# EAGLE schematic maclight-v2 (EAGLE 7.1.0)
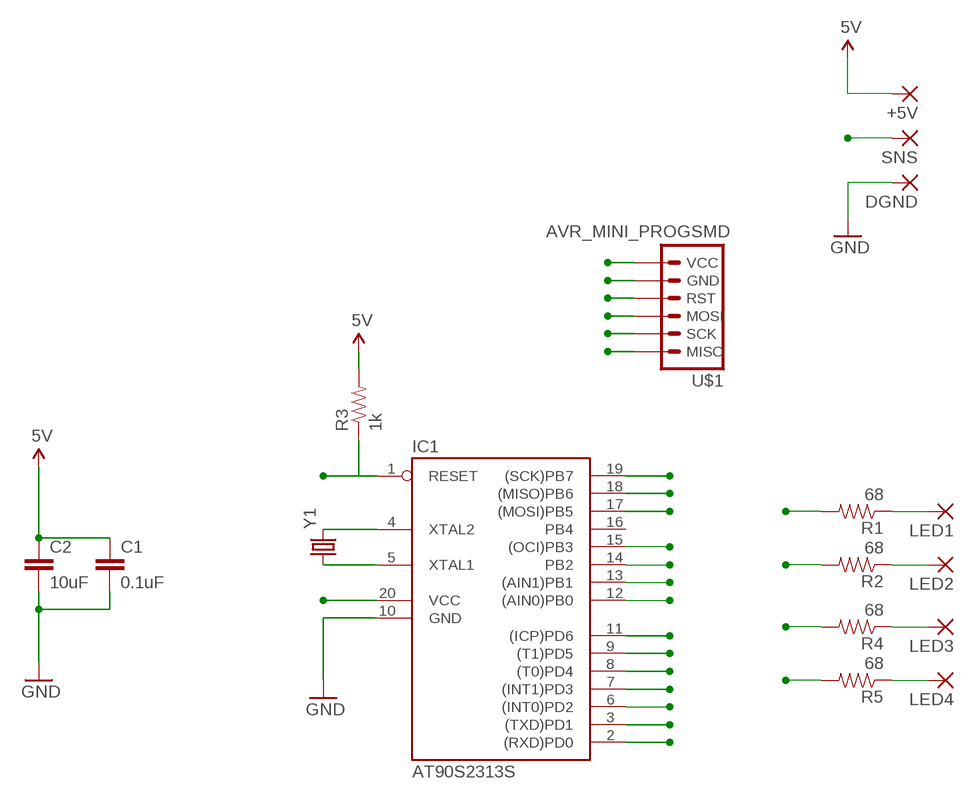
[diagram p0: schematic, sheet 1]

## Parts
+5V  SMD2  [SMD1,27-2,54]
C1  0.1uF  CAP0805  [0805]
C2  10uF  CAP1210  [1210]
DGND  SMD2  [SMD1,27-2,54]
IC1  AT90S2313S  [SO20L]
LED1  SMD2  [SMD1,27-2,54]
LED2  SMD2  [SMD1,27-2,54]
LED3  SMD2  [SMD1,27-2,54]
LED4  SMD2  [SMD1,27-2,54]
R1  68  RESISTOR0805-RES  [0805]
R2  68  RESISTOR0805-RES  [0805]
R3  1k  RESISTOR0805-RES  [0805]
R4  68  RESISTOR0805-RES  [0805]
R5  68  RESISTOR0805-RES  [0805]
SNS  SMD2  [SMD1,27-2,54]
U$1  AVR_MINI_PROGSMD  [AVR_MINI_PROG]
Y1  CRYSTAL5X3  [CRYSTAL-SMD-5X3]

## Nets
5V: +5V.1(P) C1.1 C2.1 IC1.20(VCC) R3.2 U$1.1(VCC)
/OE: IC1.11((ICP)PD6)
CLK: IC1.8((T0)PD4)
DATA: IC1.9((T1)PD5)
GND: C1.2 C2.2 DGND.1(P) IC1.10(GND) U$1.2(GND)
LE: IC1.7((INT1)PD3)
LED1: IC1.12((AIN0)PB0) R1.2
LED2: IC1.13((AIN1)PB1) R2.2
LED3: IC1.14(PB2) R4.2
LED4: IC1.15((OCI)PB3) R5.2
MISO: IC1.18((MISO)PB6) U$1.6(MISO)
MOSI/SDA: IC1.17((MOSI)PB5) U$1.4(MOSI)
N$1: LED4.1(P) R5.1
N$2: LED3.1(P) R4.1
N$3: LED2.1(P) R2.1
N$4: LED1.1(P) R1.1
N$10: IC1.5(XTAL1) Y1.1
N$12: IC1.4(XTAL2) Y1.3
PWR_SENSE: IC1.6((INT0)PD2) SNS.1(P)
RESET: IC1.1(RESET) R3.1 U$1.3(RST)
RX: IC1.2((RXD)PD0)
SCK/SCL: IC1.19((SCK)PB7) U$1.5(SCK)
TX: IC1.3((TXD)PD1)
Unconnected: IC1.16(PB4)

## Library data of the parts
+5V DGND LED1-LED4 SNS = wirepad:SMD2: SMD PAD
C1 C2 = SparkFun:CAP: Capacitor Standard 0603 ceramic capacitor, and 0.1" leaded capacitor.
IC1 = atmel:AT90S2313: MICROCONTROLLER 2 Kbytes FLASH 128 bytes SRAM 128 bytes EEPROM UART; OC_FARNELL: unknown; OC_NEWARK: unknown
R1-R5 = SparkFun:RESISTOR: Resistor Basic schematic elements and footprints for 0603, 1206, and PTH resistors.
U$1 = SparkFun-Connectors:AVR_MINI_PROG: AVR ISP 6-pin inline header
Y1 = SparkFun-FreqCtrl:CRYSTAL: Various standard crystals. Proven footprints. Spark Fun Electronics SKU : COM-00534